# EAGLE schematic ControlBoardEspV2 (EAGLE 7.2.0)
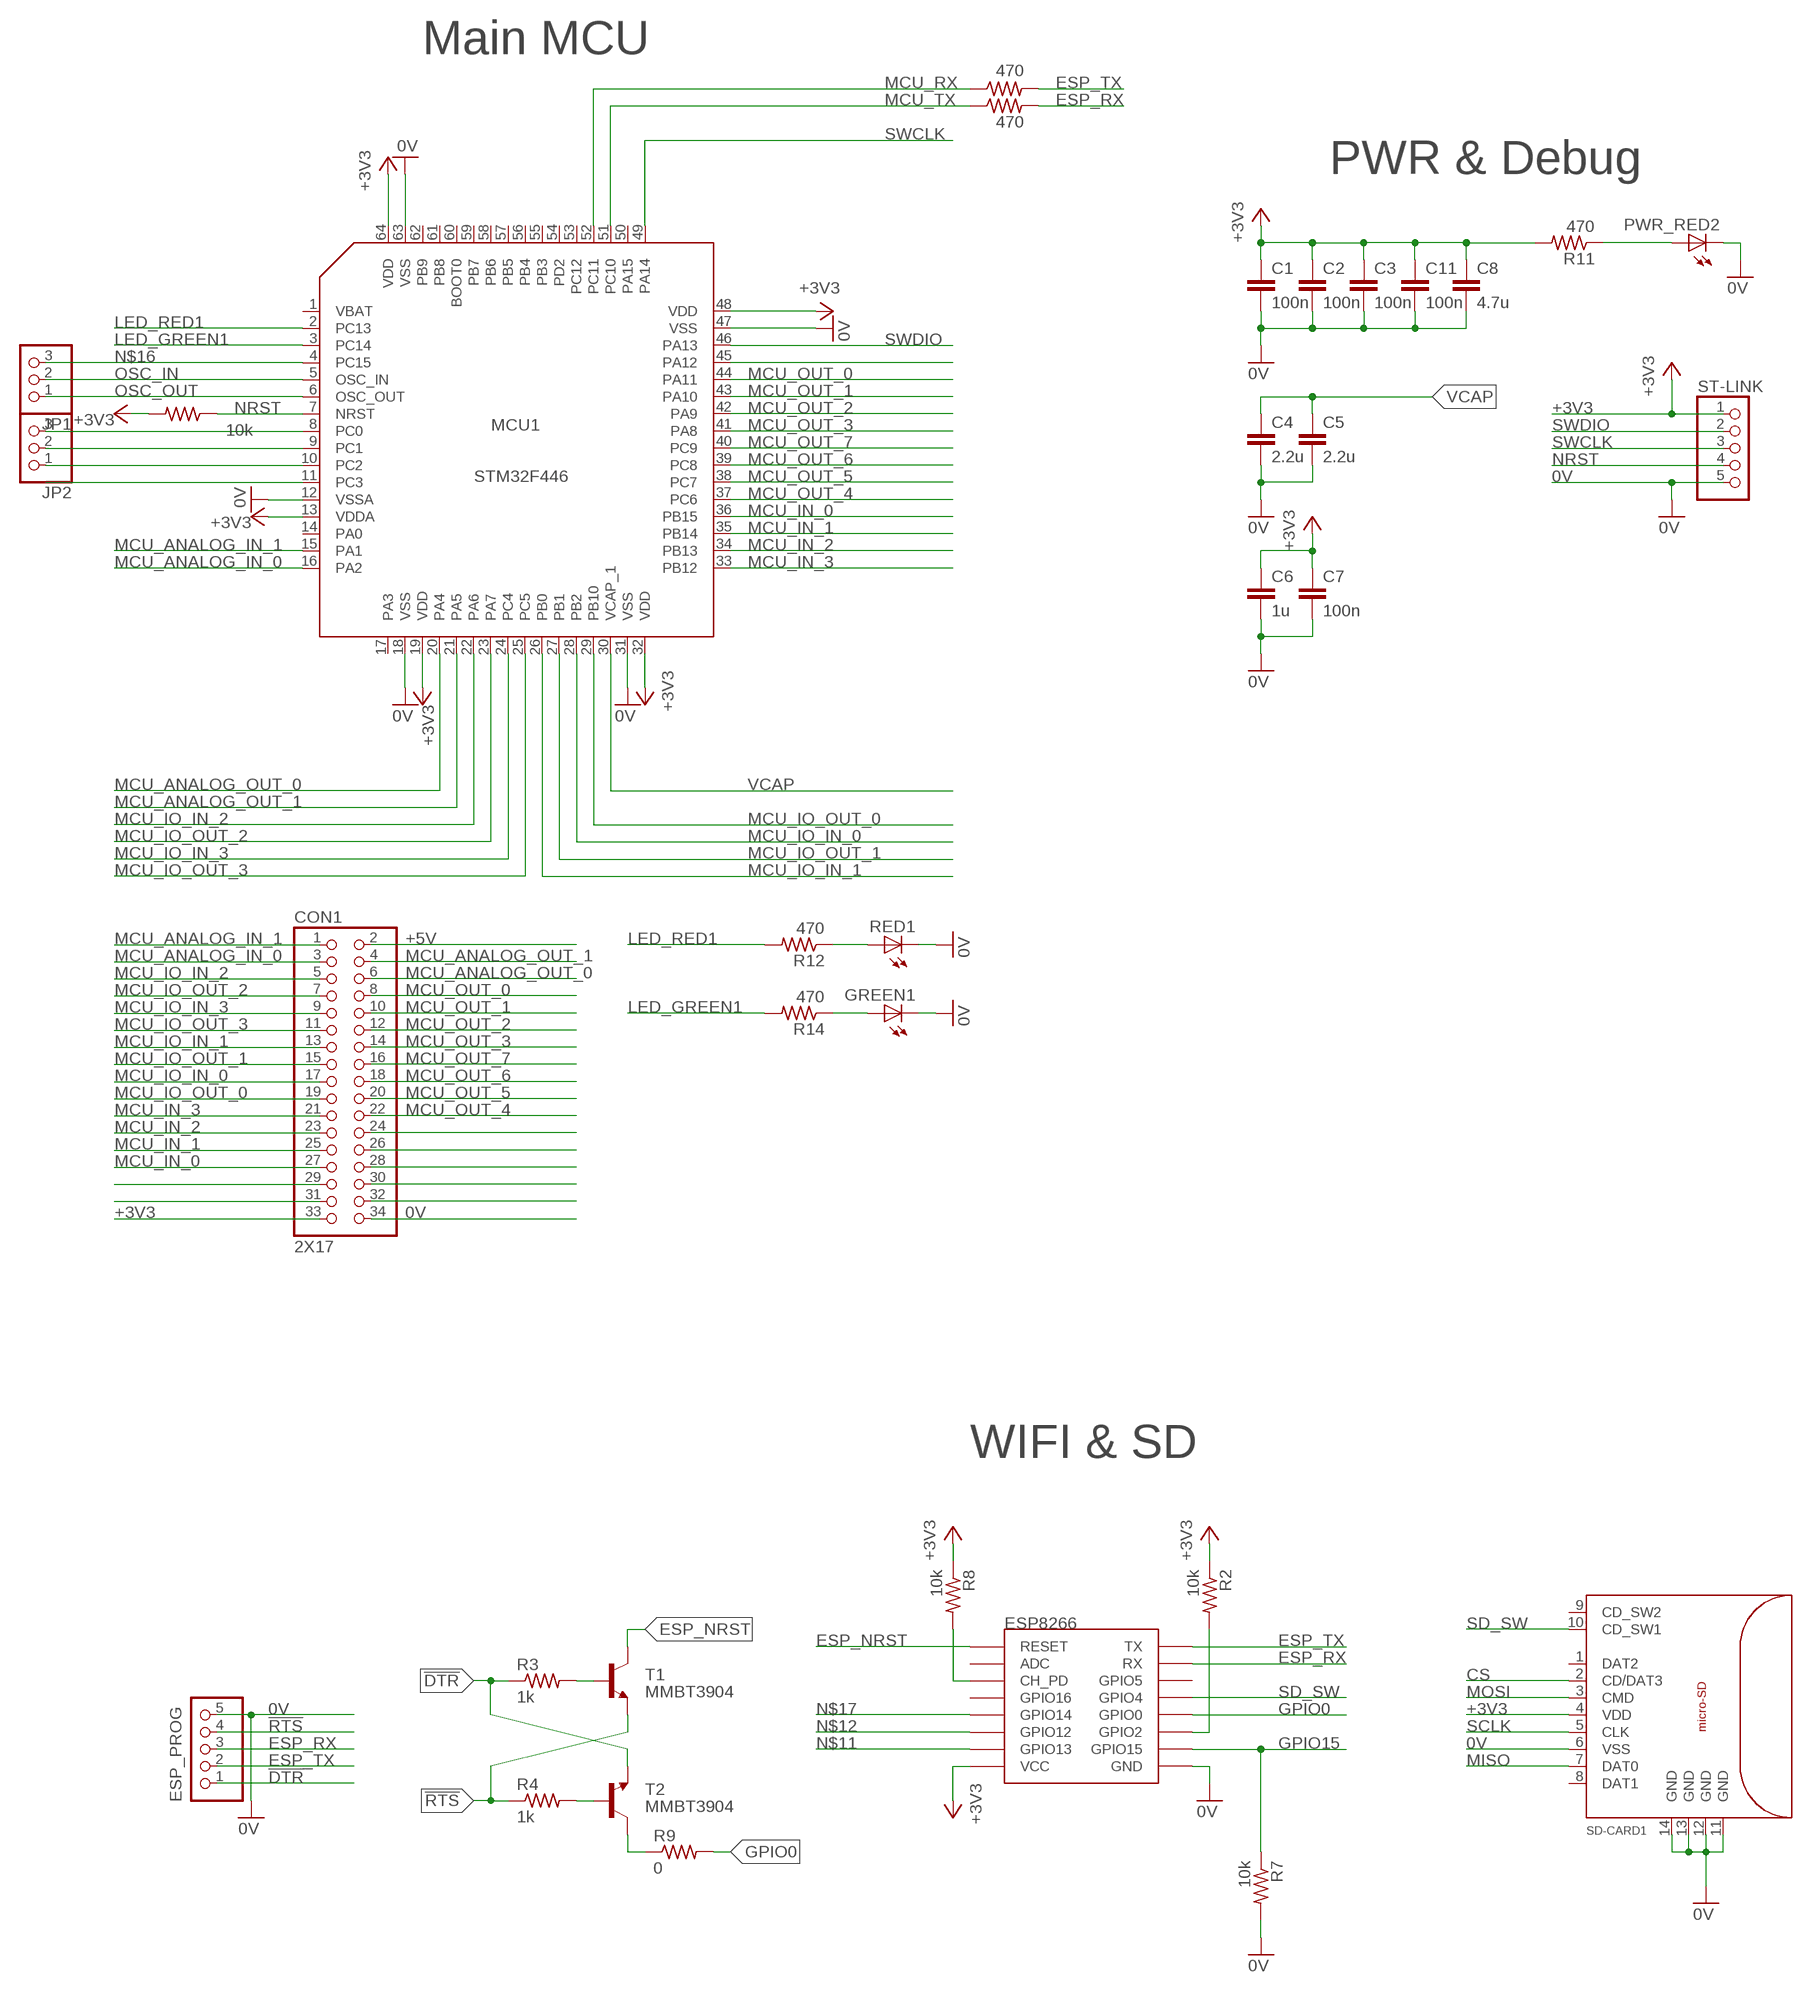
[diagram p0: schematic, sheet 1]

## Parts
C1  100n  C-EUC0402  [C0402]
C2  100n  C-EUC0402  [C0402]
C3  100n  C-EUC0402  [C0402]
C4  2.2u  C-EUC0402  [C0402]
C5  2.2u  C-EUC0402  [C0402]
C6  1u  C-EUC0402  [C0402]
C7  100n  C-EUC0402  [C0402]
C8  4.7u  C-EUC0402  [C0402]
C11  100n  C-EUC0402  [C0402]
CON1  2X17  [2X17]
ESP8266  ESP12SMD  [ESP12-SMD]
ESP_PROG  PINHD-1X5  [1X05]
GREEN1  LEDCHIP-LED0805  [CHIP-LED0805]
JP1  PINHD-1X3  [1X03]
JP2  PINHD-1X3  [1X03]
MCU1  STM32F446  [LQFP-64]
PWR_RED2  LEDCHIP-LED0805  [CHIP-LED0805]
R1  10k  R-US_R0402  [R0402]
R2  10k  R-US_R0402  [R0402]
R3  1k  R-US_R0402  [R0402]
R4  1k  R-US_R1206  [R1206]
R5  470  R-US_R0402  [R0402]
R6  470  R-US_R0402  [R0402]
R7  10k  R-US_R0402  [R0402]
R8  10k  R-US_R0402  [R0402]
R9  0  R-US_R1206  [R1206]
R11  470  R-US_R0402  [R0402]
R12  470  R-US_R0402  [R0402]
R14  470  R-US_R0402  [R0402]
RED1  LEDCHIP-LED0805  [CHIP-LED0805]
SD-CARD1  MICRO-SD  [MICRO_SD_FOOTPRINT]
ST-LINK  PINHD-1X5  [1X05]
T1  MMBT3904  MMBT3904LT1-NPN-SOT23-BEC  [SOT23-BEC]
T2  MMBT3904  MMBT3904LT1-NPN-SOT23-BEC  [SOT23-BEC]

## Nets
0V: C1.2 C2.2 C3.2 C4.2 C5.2 C6.2 C7.2 C8.2 C11.2 CON1.34 ESP8266.GND ESP_PROG.5 GREEN1.C MCU1.12(VSSA) MCU1.18(VSS) MCU1.31(VSS) MCU1.47(VSS) MCU1.63(VSS) PWR_RED2.C R7.2 RED1.C SD-CARD1.6(VSS) SD-CARD1.11(GND) SD-CARD1.12(GND) SD-CARD1.13(GND) SD-CARD1.14(GND) ST-LINK.5
!DTR!: ESP_PROG.1 R3.1 T2.E
!RTS!: ESP_PROG.4 R4.1 T1.E
+3V3: C1.1 C2.1 C3.1 C6.1 C7.1 C8.1 C11.1 CON1.33 ESP8266.VCC MCU1.13(VDDA) MCU1.19(VDD) MCU1.32(VDD) MCU1.48(VDD) MCU1.64(VDD) R1.2 R2.1 R8.1 R11.2 SD-CARD1.4(VDD) ST-LINK.1
+5V: CON1.2
CS: SD-CARD1.2(CD/DAT3)
ESP_NRST: ESP8266.RESET T1.C
ESP_RX: ESP8266.RXD0(RX) ESP_PROG.3 R6.2
ESP_TX: ESP8266.TXD0(TX) ESP_PROG.2 R5.2
GPIO0: ESP8266.GPIO0 R9.2
GPIO15: ESP8266.GPIO15 R7.1
LED_GREEN1: MCU1.3(PC14) R14.2
LED_RED1: MCU1.2(PC13) R12.2
MCU_ANALOG_IN_0: CON1.3 MCU1.16(PA2)
MCU_ANALOG_IN_1: CON1.1 MCU1.15(PA1)
MCU_ANALOG_OUT_0: CON1.6 MCU1.20(PA4)
MCU_ANALOG_OUT_1: CON1.4 MCU1.21(PA5)
MCU_IN_0: CON1.27 MCU1.36(PB15)
MCU_IN_1: CON1.25 MCU1.35(PB14)
MCU_IN_2: CON1.23 MCU1.34(PB13)
MCU_IN_3: CON1.21 MCU1.33(PB12)
MCU_IO_IN_0: CON1.17 MCU1.28(PB2)
MCU_IO_IN_1: CON1.13 MCU1.26(PB0)
MCU_IO_IN_2: CON1.5 MCU1.22(PA6)
MCU_IO_IN_3: CON1.9 MCU1.24(PC4)
MCU_IO_OUT_0: CON1.19 MCU1.29(PB10)
MCU_IO_OUT_1: CON1.15 MCU1.27(PB1)
MCU_IO_OUT_2: CON1.7 MCU1.23(PA7)
MCU_IO_OUT_3: CON1.11 MCU1.25(PC5)
MCU_OUT_0: CON1.8 MCU1.44(PA11)
MCU_OUT_1: CON1.10 MCU1.43(PA10)
MCU_OUT_2: CON1.12 MCU1.42(PA9)
MCU_OUT_3: CON1.14 MCU1.41(PA8)
MCU_OUT_4: CON1.22 MCU1.37(PC6)
MCU_OUT_5: CON1.20 MCU1.38(PC7)
MCU_OUT_6: CON1.18 MCU1.39(PC8)
MCU_OUT_7: CON1.16 MCU1.40(PC9)
MCU_RX: MCU1.52(PC11) R5.1
MCU_TX: MCU1.51(PC10) R6.1
MISO: SD-CARD1.7(DAT0)
MOSI: SD-CARD1.3(CMD)
N$1: ESP8266.GPIO2 R2.2
N$2: R3.2 T1.B
N$3: R4.2 T2.B
N$4: ESP8266.CH_PD R8.2
N$5: MCU1.45(PA12)
N$6: R9.1 T2.C
N$7: PWR_RED2.A R11.1
N$8: R12.1 RED1.A
N$9: MCU1.11(PC3)
N$10: JP2.1 MCU1.10(PC2)
N$11: ESP8266.GPIO13
N$12: ESP8266.GPIO12
N$13: GREEN1.A R14.1
N$14: JP2.2 MCU1.9(PC1)
N$15: JP2.3 MCU1.8(PC0)
N$16: JP1.3 MCU1.4(PC15)
N$17: ESP8266.GPIO14
N$123: CON1.29
N$124: CON1.31
N$137: CON1.24
N$138: CON1.26
N$139: CON1.28
N$140: CON1.30
N$141: CON1.32
NRST: MCU1.7(NRST) R1.1 ST-LINK.4
OSC_IN: JP1.2 MCU1.5(OSC_IN)
OSC_OUT: JP1.1 MCU1.6(OSC_OUT)
SCLK: SD-CARD1.5(CLK)
SD_SW: ESP8266.GPIO5(GPIO4) SD-CARD1.10(CD_SW1)
SWCLK: MCU1.49(PA14) ST-LINK.3
SWDIO: MCU1.46(PA13) ST-LINK.2
VCAP: C4.1 C5.1 MCU1.30(VCAP_1)
Unconnected: ESP8266.ADC ESP8266.GPIO4(GPIO5) ESP8266.GPIO16 MCU1.1(VBAT) MCU1.14(PA0) MCU1.17(PA3) MCU1.50(PA15) MCU1.53(PC12) MCU1.54(PD2) MCU1.55(PB3) MCU1.56(PB4) MCU1.57(PB5) MCU1.58(PB6) MCU1.59(PB7) MCU1.60(BOOT0) MCU1.61(PB8) MCU1.62(PB9) SD-CARD1.1(DAT2) SD-CARD1.8(DAT1) SD-CARD1.9(CD_SW2)

## Notes on the sheet
- Main MCU
- PWR & Debug
- WIFI & SD

## Library data of the parts
C1-C8 C11 = rcl:C-EU: CAPACITOR, European symbol
CON1 = CardEdgePads:2X17
ESP8266 = esp8266modules:ESP12: ESP8266 Wifi module 12
ESP_PROG ST-LINK = pinhead:PINHD-1X5: PIN HEADER
GREEN1 PWR_RED2 RED1 = led:LED: LED OSRAM: - CHIPLED LG R971, LG N971, LY N971, LG Q971, LY Q971, LO R971, LY R971 LH N974, LH R974 LS Q976, LO Q976, LY Q976 LO Q996 - Hyper CHIPLED LW Q18S LB Q993, LB Q99A, LB R99A - SideLED LS A670, LO A670, LY A670, LG A670, LP A670 LB A673, LV A673, LT A673, LW A673 LH A674 LY A675 LS A676, LA A676, LO A676, LY A676, LW A676 LS A679, LY A679, LG A679 - Hyper Micro SIDELED® LS Y876, LA Y876, LO Y876, LY Y876 LT Y87S - SmartLED LW L88C, LW L88S LB L89C, LB L89S, LG L890 LS L89K, LO L89K, LY L89K LS L896, LA L896, LO L896, LY L896 - TOPLED LS T670, LO T670, LY T670, LG T670, LP T670 LSG T670, LSP T670, LSY T670, LOP T670, LYG T670 LG T671, LOG T671, LSG T671 LB T673, LV T673, LT T673, LW T673 LH T674 LS T676, LA T676, LO T676, LY T676, LB T676, LH T676, LSB T676, LW T676 LB T67C, LV T67C, LT T67C, LS T67K, LO T67K, LY T67K, LW E67C LS E67B, LA E67B, LO E67B, LY E67B, LB E67C, LV E67C, LT E67C LW T67C LS T679, LY T679, LG T679 LS T770, LO T770, LY T770, LG T770, LP T770 LB T773, LV T773, LT T773, LW T773 LH T774 LS E675, LA E675, LY E675, LS T675 LS T776, LA T776, LO T776, LY T776, LB T776 LHGB T686 LT T68C, LB T68C - Hyper Mini TOPLED® LB M676 - Mini TOPLED Santana® LG M470 LS M47K, LO M47K, LY M47K Source: http://www.osram.convergy.de LUXEON: - LUMILED® LXK2-PW12-R00, LXK2-PW12-S00, LXK2-PW14-U00, LXK2-PW14-V00 LXK2-PM12-R00, LXK2-PM12-S00, LXK2-PM14-U00 LXK2-PE12-Q00, LXK2-PE12-R00, LXK2-PE12-S00, LXK2-PE14-T00, LXK2-PE14-U00 LXK2-PB12-K00, LXK2-PB12-L00, LXK2-PB12-M00, LXK2-PB14-N00, LXK2-PB14-P00, LXK2-PB14-Q00 LXK2-PR12-L00, LXK2-PR12-M00, LXK2-PR14-Q00, LXK2-PR14-R00 LXK2-PD12-Q00, LXK2-PD12-R00, LXK2-PD12-S00 LXK2-PH12-R00, LXK2-PH12-S00 LXK2-PL12-P00, LXK2-PL12-Q00, LXK2-PL12-R00 Source: www.luxeon.com KINGBRIGHT: KA-3528ASYC Source: www.kingbright.com
JP1 JP2 = pinhead:PINHD-1X3: PIN HEADER
MCU1 = STM32F446:STM32F446
R1-R9 R11 R12 R14 = rcl:R-US_: RESISTOR, American symbol
SD-CARD1 = microSD-Connector:MICRO-SD
T1 T2 = transistor-neu-to92:*-NPN-: NPN Transistror